# Altium project 28_Pins_Project_V1I2.PrjPcb (part 3 of 3)
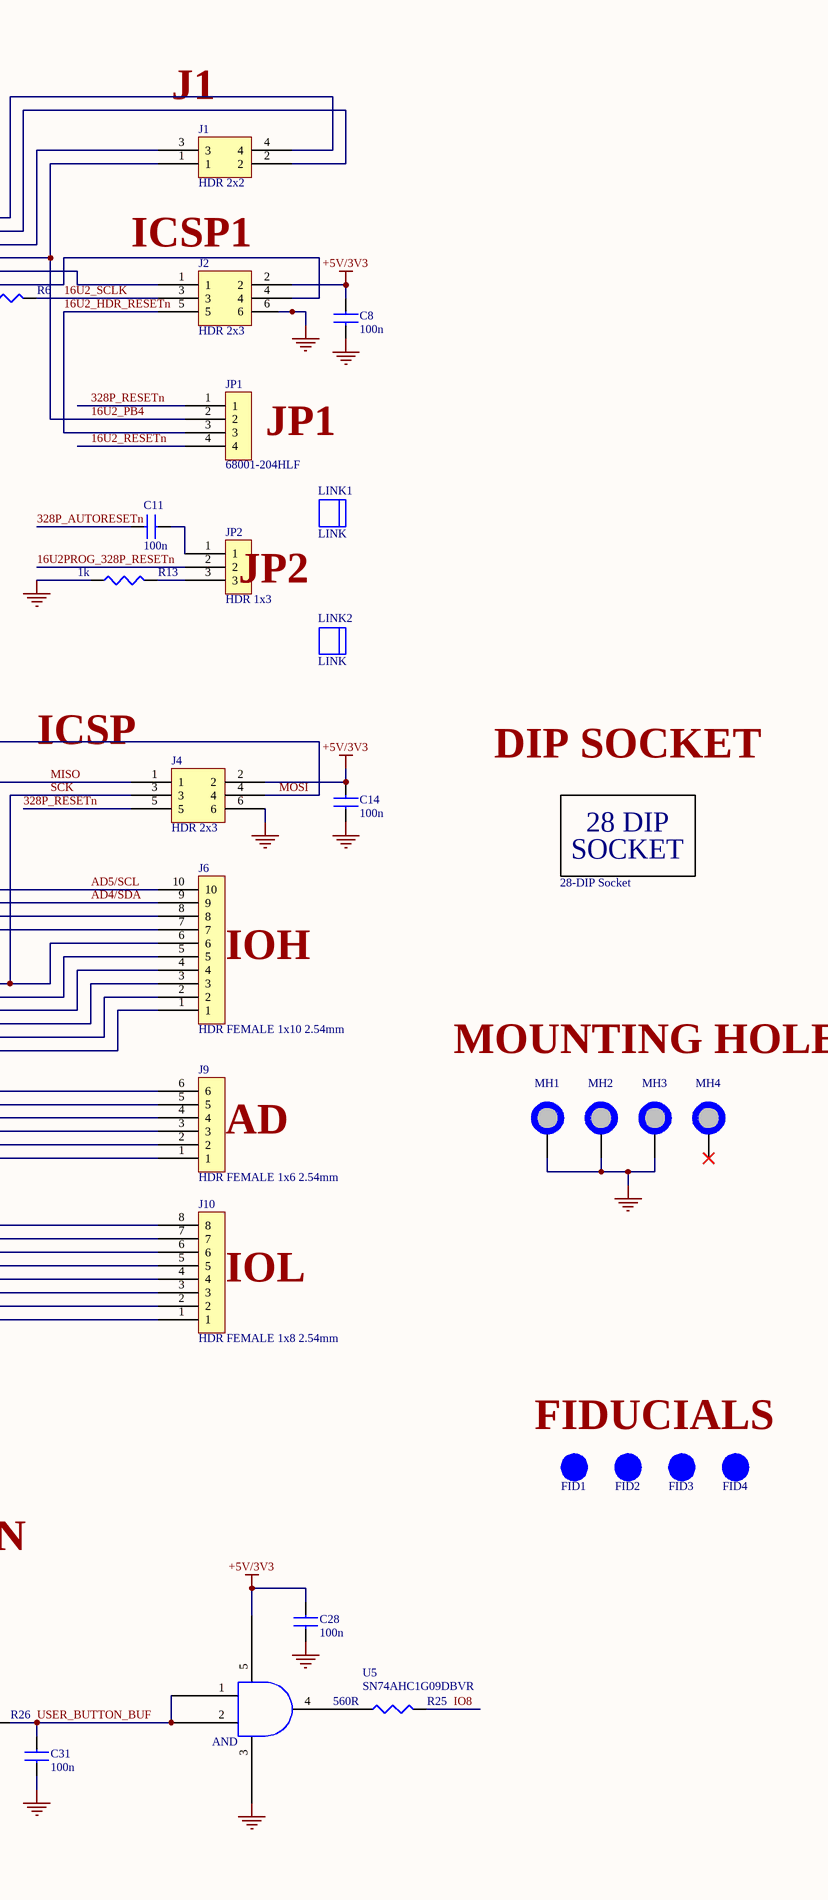
[diagram p7: [03] - 28PINS SCHEMATIC.SchDoc, right]

## Sheet [03] - 28PINS SCHEMATIC.SchDoc: 28Pins (continued)

### Library data of the parts (continued)
R5 R17 R21-R24 = RC0805FR-0710KL: RES SMD 10K OHM 1% 1/8W 0805; Manufacturer: Yageo; Resistance: 10kR; Temperature Coefficient: 100ppm/°C; Power Rating: 125mW; Voltage Rating: 150V; Supplier 1: Digi-Key; Supplier Part Number 1: 311-10.0KCRCT-ND; Manufacturer Part Number: RC0805FR-0710KL; RoHS: Yes; Category: Chip SMD Resistors; Stock 1: 7721382; Pricing 1: 1=0,10000, 10=0,04200, 100=0,01690, 1000=0,00759, 2500=0,00659 (USD); Case/Package: 0805; Case Code (Imperial): 0805; Case Code (Metric): 2012; Size Code: 0805; Min Operating Temperature: -55°C; Max Operating Temperature: 155°C; Tolerance: 1%; Resistor Type: Thick Film; Packaging: Tape and Reel; Package Quantity: 1; Termination: SMD/SMT; Number of Terminations: 2; Max Power Dissipation: 125mW; Features: Moisture Resistant; Series: RC; Construction: Rectangular; Resistance Tolerance: 1%; Technology: THICK FILM; Length: 2mm; Width: 0.049inch; Height: 0.024inch; Depth: 1.25mm; REACH SVHC: Unknown; Military Standard: Not; Lead Free: Lead Free; RoHS Compliant: Yes; ComponentLink1URL: https://datasheet.ciiva.com/11808/0900766b8106beab-11808151.pdf?src-supplier=RSComponents; ComponentLink1Description: https://datasheet.ciiva.com/11808/0900766b8106beab-11808151.pdf?src-supplier=RSComponents; ComponentLink2URL: https://datasheet.ciiva.com/12669/rc0805-12669688.pdf?src-supplier=Mouser; ComponentLink2Description: https://datasheet.ciiva.com/12669/rc0805-12669688.pdf?src-supplier=Mouser; ComponentLink3URL: https://datasheet.ciiva.com/2456/pyu-r-int-thick-7-2456974.pdf?src-supplier=Digi-Key; ComponentLink3Description: https://datasheet.ciiva.com/2456/pyu-r-int-thick-7-2456974.pdf?src-supplier=Digi-Key; ComponentLink4URL: https://datasheet.ciiva.com/2456/pyu-r-int-thick-7-2456972.pdf?src-supplier=Digi-Key; ComponentLink4Description: https://datasheet.ciiva.com/2456/pyu-r-int-thick-7-2456972.pdf?src-supplier=Digi-Key; ComponentLink5URL: https://datasheet.ciiva.com/2456/pyu-r-int-thick-7-2456973.pdf?src-supplier=Digi-Key; ComponentLink5Description: https://datasheet.ciiva.com/2456/pyu-r-int-thick-7-2456973.pdf?src-supplier=Digi-Key; ComponentLink6URL: https://datasheet.ciiva.com/16747/rc0805-16747087.pdf?src-supplier=Future+Electronics; ComponentLink6Description: https://datasheet.ciiva.com/16747/rc0805-16747087.pdf?src-supplier=Future+Electronics; ComponentLink7URL: https://datasheet.ciiva.com/46447/444164-46447563.pdf?src-supplier=Element14; ComponentLink7Description: https://datasheet.ciiva.com/46447/444164-46447563.pdf?src-supplier=Element14
R6-R8 R16 R26-R28 = RC0805FR-0722RL: RES SMD 22 OHM 1% 1/8W 0805; Manufacturer: Yageo; Temperature Coefficient: 100ppm/°C; Power Rating: 125mW; Voltage Rating: 150V; Supplier 1: Digi-Key; Supplier Part Number 1: 311-22.0CRCT-ND; Manufacturer Part Number: RC0805FR-0722RL; RoHS: Yes; Category: Chip SMD Resistors; Stock 1: 393345; Pricing 1: 1=0,10000, 10=0,04200, 100=0,01690, 1000=0,00759, 2500=0,00659 (USD); Case/Package: 0805; Case Code (Metric): 2012; Case Code (Imperial): 0805; Min Operating Temperature: -55°C; Max Operating Temperature: 155°C; Resistor Type: Thick Film; Resistance: 22R; Tolerance: 1%; Packaging: Tape and Reel; Package Quantity: 1; Number of Terminations: 2; Termination: SMD/SMT; Max Power Dissipation: 125mW; Working Voltage: 150V; Features: Moisture Resistant; Series: RC; Resistance Tolerance: 1%; Construction: Rectangular; Technology: THICK FILM; Length: 0.079inch; Width: 0.049inch; Height: 0.024inch; Depth: 1.25mm; RoHS Compliant: Yes; REACH SVHC: Unknown; Military Standard: Not; Lead Free: Lead Free; ComponentLink1URL: https://datasheet.ciiva.com/11819/0900766b8106beab-11819837.pdf?src-supplier=RSComponents; ComponentLink1Description: https://datasheet.ciiva.com/11819/0900766b8106beab-11819837.pdf?src-supplier=RSComponents; ComponentLink2URL: https://datasheet.ciiva.com/46447/444164-46447574.pdf?src-supplier=Element14; ComponentLink2Description: https://datasheet.ciiva.com/46447/444164-46447574.pdf?src-supplier=Element14; ComponentLink3URL: https://datasheet.ciiva.com/2457/pyu-r-int-thick-7-2457045.pdf?src-supplier=Digi-Key; ComponentLink3Description: https://datasheet.ciiva.com/2457/pyu-r-int-thick-7-2457045.pdf?src-supplier=Digi-Key; ComponentLink4URL: https://datasheet.ciiva.com/2457/pyu-r-int-thick-7-2457046.pdf?src-supplier=Digi-Key; ComponentLink4Description: https://datasheet.ciiva.com/2457/pyu-r-int-thick-7-2457046.pdf?src-supplier=Digi-Key; ComponentLink5URL: https://datasheet.ciiva.com/2457/pyu-r-int-thick-7-2457044.pdf?src-supplier=Digi-Key; ComponentLink5Description: https://datasheet.ciiva.com/2457/pyu-r-int-thick-7-2457044.pdf?src-supplier=Digi-Key; ComponentLink6URL: https://datasheet.ciiva.com/12667/rc0805-12667371.pdf?src-supplier=Mouser; ComponentLink6Description: https://datasheet.ciiva.com/12667/rc0805-12667371.pdf?src-supplier=Mouser
R10 R19 = RC0805FR-071ML_1: Fixed Resistor, Metal Glaze/thick Film, 0.125W, 1000000ohm, 150V, 1% +/-Tol, 100ppm/Cel, Surface Mount, 0805; Manufacturer: Yageo Phycomp; Power Rating: 125mW; Temperature Coefficient: 100ppm/°C; Resistance: 1MR; Supplier 1: Digi-Key; Supplier Part Number 1: 311-1.00MCRCT-ND; Manufacturer Part Number: RC0805FR-071ML; RoHS: Yes; Category: Chip SMD Resistors; Stock 1: 389617; Pricing 1: 1=0,10000, 10=0,04200, 100=0,01690, 1000=0,00759, 2500=0,00659 (USD); Mount: Surface Mount; Case/Package: 0805; Number of Pins: 2; Min Operating Temperature: -55°C; Max Operating Temperature: 155°C; Tolerance: 1%; Packaging: Cut Tape; Voltage Rating (DC): 150V; Length: 2mm; Width: 1.25mm; Height: 0.5mm; Depth: 1.25mm; REACH SVHC: No SVHC; Lead Free: Lead Free; ComponentLink1URL: http://www.mouser.com/ds/2/447/Yageo_08112016_RC0805-968729.pdf?src-supplier=Mouser; ComponentLink1Description: http://www.mouser.com/ds/2/447/Yageo_08112016_RC0805-968729.pdf?src-supplier=Mouser; ComponentLink2URL: http://www.farnell.com/datasheets/2167052.pdf?src-supplier=Farnell; ComponentLink2Description: http://www.farnell.com/datasheets/2167052.pdf?src-supplier=Farnell; ComponentLink3URL: http://www.yageo.com/documents/recent/PYu-RC_Group_51_RoHS_L_10.pdf?src-supplier=Digi-Key; ComponentLink3Description: http://www.yageo.com/documents/recent/PYu-RC_Group_51_RoHS_L_10.pdf?src-supplier=Digi-Key; ComponentLink4URL: http://www.farnell.com/datasheets/2167052.pdf?src-supplier=Newark; ComponentLink4Description: http://www.farnell.com/datasheets/2167052.pdf?src-supplier=Newark; ComponentLink5URL: http://www.farnell.com/datasheets/444164.pdf?src-supplier=Element14; ComponentLink5Description: http://www.farnell.com/datasheets/444164.pdf?src-supplier=Element14
R11-R13 = RC0805FR-071KL: RES SMD 1K OHM 1% 1/8W 0805; Manufacturer: Yageo; Resistance: 1kR; Temperature Coefficient: 100ppm/°C; Voltage Rating (DC): 150V; Power Rating: 125mW; Supplier 1: Digi-Key; Supplier Part Number 1: 311-1.00KCRCT-ND; Manufacturer Part Number: RC0805FR-071KL; RoHS: Yes; Category: Chip SMD Resistors; Stock 1: 5091095; Pricing 1: 1=0,10000, 10=0,04200, 100=0,01690, 1000=0,00759, 2500=0,00659 (USD); Case/Package: 0805; Number of Pins: 2; Case Code (Metric): 2012; Case Code (Imperial): 0805; Size Code: 0805; Min Operating Temperature: -55°C; Max Operating Temperature: 155°C; Tolerance: 1%; Resistor Type: Thick Film; Packaging: Tape and Reel; Package Quantity: 1; Voltage Rating: 150V; Number of Terminations: 2; Termination: SMD/SMT; Max Power Dissipation: 125mW; Features: Moisture Resistant; Series: RC; Resistance Tolerance: 1%; Construction: Rectangular; Length: 0.079inch; Width: 0.049inch; Height: 0.024inch; Depth: 1.25mm; REACH SVHC: Unknown; Lead Free: Lead Free; RoHS Compliant: Yes; Military Standard: Not; ComponentLink1URL: https://datasheet.ciiva.com/46385/444164-46385020.pdf?src-supplier=Element14; ComponentLink1Description: https://datasheet.ciiva.com/46385/444164-46385020.pdf?src-supplier=Element14; ComponentLink2URL: https://datasheet.ciiva.com/2456/pyu-r-int-thick-7-2456975.pdf?src-supplier=Digi-Key; ComponentLink2Description: https://datasheet.ciiva.com/2456/pyu-r-int-thick-7-2456975.pdf?src-supplier=Digi-Key; ComponentLink3URL: https://datasheet.ciiva.com/2456/pyu-r-int-thick-7-2456976.pdf?src-supplier=Digi-Key; ComponentLink3Description: https://datasheet.ciiva.com/2456/pyu-r-int-thick-7-2456976.pdf?src-supplier=Digi-Key; ComponentLink4URL: https://datasheet.ciiva.com/2456/pyu-r-int-thick-7-2456977.pdf?src-supplier=Digi-Key; ComponentLink4Description: https://datasheet.ciiva.com/2456/pyu-r-int-thick-7-2456977.pdf?src-supplier=Digi-Key; ComponentLink5URL: https://datasheet.ciiva.com/16850/rc0805-16850409.pdf?src-supplier=Future+Electronics; ComponentLink5Description: https://datasheet.ciiva.com/16850/rc0805-16850409.pdf?src-supplier=Future+Electronics; ComponentLink6URL: https://datasheet.ciiva.com/7941/1686128-7941719.pdf?src-supplier=Element14; ComponentLink6Description: https://datasheet.ciiva.com/7941/1686128-7941719.pdf?src-supplier=Element14
SCKT_FOR_U1 = 4828-3004-CP: CONN IC DIP SOCKET 28POS TIN; Manufacturer: 3M; Number of Contacts: 28; Gender: Female; Insulation Resistance: 5GR; Current Rating: 1A; Pitch: 2.54mm; Row Spacing: 7.62mm; Supplier 1: Digi-Key; Supplier Part Number 1: 3M5480-ND; Manufacturer Part Number: 4828-3004-CP; RoHS: Yes; Category: Connectors; Stock 1: 5444; Pricing 1: 1=0,90000, 10=0,76200, 25=0,73040, 40=0,71500, 80=0,68388, 230=0,62174, 440=0,55959, 945=0,49741, 2400=0,45078 (USD); Mount: Through Hole; Contact Plating: Tin; Contact Material: Bronze; Housing Material: Glass; Insulation Material: Polyester; Min Operating Temperature: -25°C; Max Operating Temperature: 85°C; Number of Rows: 2; Termination: Solder; Orientation: Straight; Package Quantity: 5600; Number of Positions: 28; Connector Type: DIP; Series: 4800; Length: 35.43mm; Width: 10.16mm; Depth: 10.16mm; REACH SVHC: Unknown; Lead Free: Lead Free; ComponentLink1URL: https://datasheet.ciiva.com/768/ts1099-768354.pdf?src-supplier=Digi-Key; ComponentLink1Description: https://datasheet.ciiva.com/768/ts1099-768354.pdf?src-supplier=Digi-Key
SW1 SW2 = 1825910-6: 6X6, H5,  160G TAC.SWITCH; Manufacturer: TE Connectivity Alcoswitch; Mechanical Life: 100000Cycles; Actuator Material: PBT; Actuator Color: Black; Operating Force: 160gf; Illumination Type: Non-Illuminated,Illuminated; Throw Configuration: SPST; Contact Current Rating: 50mA; Max Voltage Rating (DC): 24V; Contact Resistance: 100mR; Switch Travel: 0.25mm; Switch Function: Off-Mom; Actuator Type: Standard; Actuator Length: 0.055inch; Supplier 1: Digi-Key; Supplier Part Number 1: 450-1650-ND; Manufacturer Part Number: 1825910-6; RoHS: Yes; Category: Pushbutton Switches; Stock 1: 152648; Pricing 1: 1=0,11000, 10=0,11100, 25=0,10520, 100=0,09550, 250=0,08980, 500=0,08216, 1000=0,06879, 2500=0,06688, 5000=0,06306 (USD); Mount: Through Hole; Contact Material: Copper Alloy; Contact Plating: Silver; Min Operating Temperature: -35°C; Max Operating Temperature: 85°C; Termination: PC Pins; Package Quantity: 750; Orientation: Straight; Series: FSMJ; Packaging: Loose Piece; Electrical Life: 100000Cycles; Type: Switch; Max Current Rating: 50mA; Length: 5.99mm; RoHS Compliant: Yes; REACH SVHC: Unknown; ELV: Compliant; Lead Free: Lead Free; ComponentLink1URL: https://datasheet.ciiva.com/30199/1825910-6rqpn1825910-6-30199520.pdf?src-supplier=Onlinecomponents.com; ComponentLink1Description: https://datasheet.ciiva.com/30199/1825910-6rqpn1825910-6-30199520.pdf?src-supplier=Onlinecomponents.com; ComponentLink2URL: https://datasheet.ciiva.com/15184/getdatasheetpartid-395915-15184509.pdf?src-supplier=Verical; ComponentLink2Description: https://datasheet.ciiva.com/15184/getdatasheetpartid-395915-15184509.pdf?src-supplier=Verical
U1 = ATMEGA16U2-AU: ATmega Series 16 KB Flash 512 B RAM 16 MHz 8-Bit Microcontroller - TQFP-32; Manufacturer: Microchip / Atmel; Core Architecture: AVR; Interface: SPI,UART,USB,USART,Serial; Frequency: 16MHz; Data Bus Width: 8b; Memory Size: 16KB; RAM Size: 512B; Number of I/Os: 22; Number of Timers/Counters: 2; Max Supply Voltage: 5.5V; Min Supply Voltage: 2.7V; Oscillator Type: Internal; Watchdog Timer: Yes; Peripherals: Brown-out Detect/Reset,POR,PWM,WDT; Number of PWM Channels: 5; Number of SPI Channels: 1; Supplier 1: Digi-Key; Supplier Part Number 1: ATMEGA16U2-AU-ND; Manufacturer Part Number: ATMEGA16U2-AU; RoHS: Yes; Category: Microcontrollers; Stock 1: 1165; Pricing 1: 1=2,96000, 25=2,71400, 100=2,46100 (USD); Mount: Surface Mount; Case/Package: A; Number of Pins: 32; Contact Plating: Tin,Matte; Min Operating Temperature: -40°C; Max Operating Temperature: 85°C; Package Quantity: 1250; Packaging: Tray; Memory Type: FLASH; Series: AVR® ATmega; Number of Programmable I/O: 22; Max Frequency: 16MHz; Length: 7mm; Width: 7mm; Height: 1.05mm; REACH SVHC: No SVHC; Lead Free: Lead Free; RoHS Compliant: Yes; ComponentLink1URL: https://datasheet.ciiva.com/13036/doc7799-28769-13036800.pdf?src-supplier=Mouser; ComponentLink1Description: https://datasheet.ciiva.com/13036/doc7799-28769-13036800.pdf?src-supplier=Mouser; ComponentLink2URL: https://datasheet.ciiva.com/22651/doc7799-22651110.pdf?src-supplier=Farnell; ComponentLink2Description: https://datasheet.ciiva.com/22651/doc7799-22651110.pdf?src-supplier=Farnell
U2 = TL1963A-33DCQR: IC REG LINEAR 3.3V 1.5A SOT223-6; Manufacturer: Texas Instruments; Dropout Voltage: 340mV; Number of Outputs: 1; Max Input Voltage: 20V; Min Input Voltage: 2.1V; Min Current Limit: 1.6A; Input Bias Current: 1mA; Polarity: Positive; Accuracy: 3%; Output Type: Fixed; Supplier 1: Digi-Key; Supplier Part Number 1: 296-24534-1-ND; Manufacturer Part Number: TL1963A-33DCQR; RoHS: Yes; Category: Voltage Regulators - Linear; Stock 1: 2684; Pricing 1: 1=3,26000, 10=2,93100, 25=2,77120, 100=2,40190, 250=2,27868, 500=2,04466, 1000=2,03350 (USD); Case/Package: SOT-223; Number of Pins: 6; Contact Plating: Gold; Min Operating Temperature: -40°C; Max Operating Temperature: 125°C; Package Quantity: 1; Packaging: Tape and Reel; Output Voltage: 3.3V; Output Current: 1.5A; Max Output Current: 1.5A; Number of Regulators: 1; Quiescent Current: 1mA; Max Output Voltage: 3.3V; Min Output Voltage: 3.3V; Series: -; Radiation Hardening: No; Lead Free: Lead Free; RoHS Compliant: Yes; ComponentLink1URL: https://datasheet.ciiva.com/2046/tl1963a-2046161.pdf?src-supplier=Digi-Key; ComponentLink1Description: https://datasheet.ciiva.com/2046/tl1963a-2046161.pdf?src-supplier=Digi-Key; ComponentLink2URL: https://datasheet.ciiva.com/2046/tl1963a-2046162.pdf?src-supplier=Digi-Key; ComponentLink2Description: https://datasheet.ciiva.com/2046/tl1963a-2046162.pdf?src-supplier=Digi-Key; ComponentLink3URL: https://datasheet.ciiva.com/2046/tl1963a-2046163.pdf?src-supplier=Digi-Key; ComponentLink3Description: https://datasheet.ciiva.com/2046/tl1963a-2046163.pdf?src-supplier=Digi-Key; ComponentLink4URL: https://datasheet.ciiva.com/26176/tl1963a-25-26176569.pdf?src-supplier=Avnet+Europe; ComponentLink4Description: https://datasheet.ciiva.com/26176/tl1963a-25-26176569.pdf?src-supplier=Avnet+Europe
U3 = ATMEGA328-PU: MCU 8-bit ATmega AVR RISC 32KB Flash 2.5V/3.3V/5V 28-Pin PDIP; Manufacturer: Microchip / Atmel; RAM Size: 2KB; Interface: SPI,USART,2-Wire,I2C,UART; Number of I/Os: 23; Number of Timers/Counters: 3; Max Supply Voltage: 5.5V; Min Supply Voltage: 1.8V; Frequency: 20MHz; Number of PWM Channels: 6; Data Bus Width: 8b; Oscillator Type: Internal; Number of SPI Channels: 1; Watchdog Timer: Yes; Peripherals: Brown-out Detect/Reset,POR,PWM,WDT; Supplier 1: Digi-Key; Supplier Part Number 1: ATMEGA328-PU-ND; Manufacturer Part Number: ATMEGA328-PU; RoHS: Yes; Category: Microcontrollers; Stock 1: 25229; Pricing 1: 1=2,40000, 25=2,19640, 100=2,00100 (USD); Mount: Through Hole; Case/Package: PDIP; Number of Pins: 28; Contact Plating: Tin,Matte; Min Operating Temperature: -40°C; Max Operating Temperature: 85°C; Package Quantity: 14; Core Architecture: AVR; Series: AVR® ATmega; Packaging: Rail/Tube; Number of ADC Channels: 6; Number of Programmable I/O: 23; Max Frequency: 20MHz; Number of I2C Channels: 1; Memory Type: FLASH; Memory Size: 32KB; Length: 34.8mm; Width: 7.49mm; Height: 4.572mm; Radiation Hardening: No; RoHS Compliant: Yes; REACH SVHC: No SVHC; Lead Free: Lead Free; ComponentLink1URL: https://datasheet.ciiva.com/20168/73-4281-20168377.pdf?src-supplier=Rapid+Electronics; ComponentLink1Description: https://datasheet.ciiva.com/20168/73-4281-20168377.pdf?src-supplier=Rapid+Electronics; ComponentLink2URL: https://datasheet.ciiva.com/1157/1684409-1157692.pdf?src-supplier=Element14; ComponentLink2Description: https://datasheet.ciiva.com/1157/1684409-1157692.pdf?src-supplier=Element14
U4-U7 = SN74AHC1G09DBVR: TEXAS INSTRUMENTS - SN74AHC1G09DBVR - AND Gate, 74AHC1G09, 2 Input, 2 V to 5.5 V, SOT-23-5; Min Supply Voltage: 2V; Max Supply Voltage: 5.5V; Quiescent Current: 1uA; Number of Inputs: 2; Propagation Delay: 7.5ns; Output Current: 25mA; Number of Circuits: 1; Low Level Output Current: 8mA; Supplier 1: Digi-Key; Supplier Part Number 1: 296-29202-1-ND; Manufacturer: Texas Instruments; Manufacturer Part Number: SN74AHC1G09DBVR; RoHS: Yes; Category: Logic Gates; Pricing 1: 1=0,40000, 10=0,29700, 25=0,25960, 100=0,16810, 250=0,13912, 500=0,11130, 1000=0,08533 (USD); Mount: Surface Mount; Case/Package: SOT-23; Number of Pins: 5; Contact Plating: Tin,Matte; Min Operating Temperature: -55°C; Max Operating Temperature: 125°C; Logic Function: AND GATE; Package Quantity: 3000; Packaging: Tape and Reel; Number of Gates: 1; Number of Elements: 1; Number of Bits: 1; Series: 74AHC; Technology: CMOS; Output Voltage: 5.5V; Number of Outputs: 1; Radiation Hardening: No; REACH SVHC: No SVHC; Lead Free: Lead Free; RoHS Compliant: Yes; ComponentLink1URL: https://datasheet.ciiva.com/1864/sn74ahc1g09-1864410.pdf?src-supplier=Digi-Key; ComponentLink1Description: https://datasheet.ciiva.com/1864/sn74ahc1g09-1864410.pdf?src-supplier=Digi-Key; ComponentLink2URL: https://datasheet.ciiva.com/1864/sn74ahc1g09-1864411.pdf?src-supplier=Digi-Key; ComponentLink2Description: https://datasheet.ciiva.com/1864/sn74ahc1g09-1864411.pdf?src-supplier=Digi-Key; ComponentLink3URL: https://datasheet.ciiva.com/1864/sn74ahc1g09-1864412.pdf?src-supplier=Digi-Key; ComponentLink3Description: https://datasheet.ciiva.com/1864/sn74ahc1g09-1864412.pdf?src-supplier=Digi-Key
Y1 Y2 = ABM7-16.000MHZ-D2Y-T: CRYSTAL 16.0000MHZ 18PF SMD; Manufacturer: Abracon; Frequency Tolerance: 20ppm; ESR (Equivalent Series Resistance): 50R; Frequency: 16MHz; Frequency Stability: 30ppm; Operating Frequency: 16 MHz; Supplier 1: Digi-Key; Supplier Part Number 1: 535-9840-1-ND; Manufacturer Part Number: ABM7-16.000MHZ-D2Y-T; RoHS: Yes; Category: Crystals; Pricing 1: 1=0,87000, 10=0,77300, 50=0,72240, 100=0,63840, 500=0,60480 (USD); Mount: Surface Mount; Case/Package: CSMD; Number of Pins: 2; Min Operating Temperature: -40°C; Max Operating Temperature: 85°C; Load Capacitance: 18pF; Package Quantity: 1000; Tolerance: 20ppm; Packaging: Tape and Reel; Termination: SMD/SMT; Resistor Type: Ceramic; Series: ABM7; Length: 6mm; Width: 3.3mm; Height: 0.055inch; Depth: 3.5mm; Radiation Hardening: No; REACH SVHC: Unknown; Lead Free: Lead Free; ComponentLink1URL: https://datasheet.ciiva.com/15116/getdatasheetpartid-721624-15116835.pdf?src-supplier=Verical; ComponentLink1Description: https://datasheet.ciiva.com/15116/getdatasheetpartid-721624-15116835.pdf?src-supplier=Verical; ComponentLink2URL: https://datasheet.ciiva.com/5788/abm7-5788054.pdf?src-supplier=Farnell; ComponentLink2Description: https://datasheet.ciiva.com/5788/abm7-5788054.pdf?src-supplier=Farnell; ComponentLink3URL: https://datasheet.ciiva.com/18649/abm7-18649865.pdf?src-supplier=Digi-Key; ComponentLink3Description: https://datasheet.ciiva.com/18649/abm7-18649865.pdf?src-supplier=Digi-Key; ComponentLink4URL: https://datasheet.ciiva.com/18649/abm7-18649866.pdf?src-supplier=Digi-Key; ComponentLink4Description: https://datasheet.ciiva.com/18649/abm7-18649866.pdf?src-supplier=Digi-Key; ComponentLink5URL: https://datasheet.ciiva.com/18649/abm7-18649867.pdf?src-supplier=Digi-Key; ComponentLink5Description: https://datasheet.ciiva.com/18649/abm7-18649867.pdf?src-supplier=Digi-Key; ComponentLink6URL: https://datasheet.ciiva.com/16383/abm7-16383174.pdf?src-supplier=Future+Electronics; ComponentLink6Description: https://datasheet.ciiva.com/16383/abm7-16383174.pdf?src-supplier=Future+Electronics; ComponentLink7URL: https://datasheet.ciiva.com/7998/947971-7998600.pdf?src-supplier=Element14; ComponentLink7Description: https://datasheet.ciiva.com/7998/947971-7998600.pdf?src-supplier=Element14; ComponentLink8URL: https://datasheet.ciiva.com/26941/getdatasheetpartid-719818-26941724.pdf?src-supplier=Verical; ComponentLink8Description: https://datasheet.ciiva.com/26941/getdatasheetpartid-719818-26941724.pdf?src-supplier=Verical; ComponentLink9URL: https://datasheet.ciiva.com/22658/947971-22658293.pdf?src-supplier=Element14; ComponentLink9Description: https://datasheet.ciiva.com/22658/947971-22658293.pdf?src-supplier=Element14; ComponentLink10URL: https://datasheet.ciiva.com/46385/947971-46385243.pdf?src-supplier=Element14; ComponentLink10Description: https://datasheet.ciiva.com/46385/947971-46385243.pdf?src-supplier=Element14
Z1 Z2 = CG0603MLC-05E: VARISTOR 0603; Manufacturer: Bourns; Capacitance: 0.5pF; Voltage Rating (DC): 5V; Voltage Rating (AC): 8V; Number of Channels: 1; Clamping Voltage: 20V; Current Rating: 50nA; Turn-On Delay Time: 1ns; Element Configuration: Single; Supplier 1: Digi-Key; Supplier Part Number 1: CG0603MLC-05ECT-ND; Manufacturer Part Number: CG0603MLC-05E; RoHS: Yes; Category: Varistors; Stock 1: 133173; Pricing 1: 1=0,49000, 10=0,34800, 25=0,28600, 100=0,22880, 250=0,16640, 500=0,13520, 1000=0,10400, 2500=0,09360 (USD); Case/Package: 0603; Number of Pins: 2; Case Code (Imperial): 0603; Case Code (Metric): 1608; Contact Plating: Tin; Min Operating Temperature: -40°C; Max Operating Temperature: 85°C; Operating Supply Voltage: 5V; Package Quantity: 1; Packaging: Tape and Reel; Termination: SMD/SMT; Voltage: 5V; Number of Circuits: 1; Max Voltage Rating (DC): 5V; Working Voltage: 5V; Leakage Current: 50nA; Series: MLC; Length: 1.6mm; Width: 0.8mm; Depth: 0.8mm; Thickness: 0.8mm; Radiation Hardening: No; REACH SVHC: No SVHC; RoHS Compliant: Yes; ComponentLink1URL: https://datasheet.ciiva.com/27747/1163231-27747629.pdf?src-supplier=Jameco; ComponentLink1Description: https://datasheet.ciiva.com/27747/1163231-27747629.pdf?src-supplier=Jameco; ComponentLink2URL: https://datasheet.ciiva.com/1278/1785244-1278701.pdf?src-supplier=Element14; ComponentLink2Description: https://datasheet.ciiva.com/1278/1785244-1278701.pdf?src-supplier=Element14; ComponentLink3URL: https://datasheet.ciiva.com/8084/mlc-8084047.pdf?src-supplier=Avnet; ComponentLink3Description: https://datasheet.ciiva.com/8084/mlc-8084047.pdf?src-supplier=Avnet; ComponentLink4URL: https://datasheet.ciiva.com/6991/mlc-6991832.pdf?src-supplier=Digi-Key; ComponentLink4Description: https://datasheet.ciiva.com/6991/mlc-6991832.pdf?src-supplier=Digi-Key; ComponentLink5URL: https://datasheet.ciiva.com/6991/mlc-6991834.pdf?src-supplier=Digi-Key; ComponentLink5Description: https://datasheet.ciiva.com/6991/mlc-6991834.pdf?src-supplier=Digi-Key; ComponentLink6URL: https://datasheet.ciiva.com/6991/mlc-6991836.pdf?src-supplier=Digi-Key; ComponentLink6Description: https://datasheet.ciiva.com/6991/mlc-6991836.pdf?src-supplier=Digi-Key; ComponentLink7URL: https://datasheet.ciiva.com/30070/mlc-30070503.pdf?src-supplier=Onlinecomponents.com; ComponentLink7Description: https://datasheet.ciiva.com/30070/mlc-30070503.pdf?src-supplier=Onlinecomponents.com; ComponentLink8URL: https://datasheet.ciiva.com/25958/mlc-25958222.pdf?src-supplier=Avnet+Europe; ComponentLink8Description: https://datasheet.ciiva.com/25958/mlc-25958222.pdf?src-supplier=Avnet+Europe; ComponentLink9URL: https://datasheet.ciiva.com/22696/1785244-22696318.pdf?src-supplier=Element14; ComponentLink9Description: https://datasheet.ciiva.com/22696/1785244-22696318.pdf?src-supplier=Element14

## Assembly variants
FIXED 5V: not fitted J1 JP3 LINK3 R4 R15
5V/3V3: not fitted J1 R4 R14 R15; alternate parts Y2 -> ABM7-8.000MHZ-D2Y-T, Y1 -> ABM7-10.000MHZ-D2Y-T